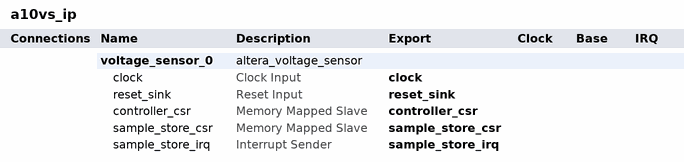
[diagram p0: system contents]
# Platform Designer (Qsys) system a10vs_ip, Arria 10 10AX027H2F34E2SG
# Parameters at their usual value, and those the tool derives, are not listed.
package require -exact qsys 23.1
create_system a10vs_ip
set_project_property DEVICE_FAMILY {Arria 10}
set_project_property DEVICE 10AX027H2F34E2SG

add_instance voltage_sensor_0 altera_voltage_sensor 23.1
set_instance_property voltage_sensor_0 AUTO_EXPORT true
set_instance_parameter_value voltage_sensor_0 CORE_VAR 0
set_instance_parameter_value voltage_sensor_0 MEM_TYPE 0

# exported interfaces
add_interface clock clock sink
set_interface_property clock EXPORT_OF voltage_sensor_0.clock
add_interface controller_csr avalon slave
set_interface_property controller_csr EXPORT_OF voltage_sensor_0.controller_csr
add_interface reset_sink reset sink
set_interface_property reset_sink EXPORT_OF voltage_sensor_0.reset_sink
add_interface sample_store_csr avalon slave
set_interface_property sample_store_csr EXPORT_OF voltage_sensor_0.sample_store_csr
add_interface sample_store_irq interrupt sender
set_interface_property sample_store_irq EXPORT_OF voltage_sensor_0.sample_store_irq

set_interconnect_requirement {$system} qsys_mm.clockCrossingAdapter HANDSHAKE
set_interconnect_requirement {$system} qsys_mm.enableEccProtection FALSE
set_interconnect_requirement {$system} qsys_mm.insertDefaultSlave FALSE
set_interconnect_requirement {$system} qsys_mm.maxAdditionalLatency 1

save_system a10vs_ip.qsys
